# Altium schematic sheet Cap.SchDoc
size A4
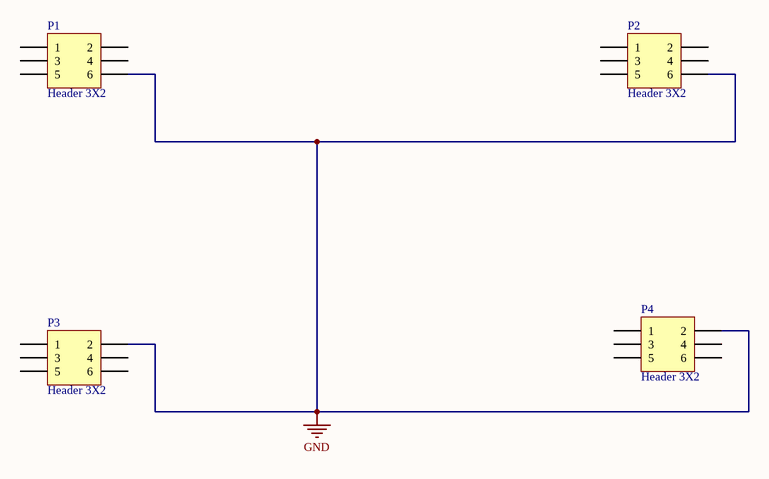
[diagram p0: Cap.SchDoc]

## Parts
P1  Header 3X2  [HDR2X3]
P2  Header 3X2  [HDR2X3]
P3  Header 3X2  [HDR2X3]
P4  Header 3X2  [HDR2X3]

## Nets
GND: P1.6 P2.6 P3.2 P4.2

Not connected (* = marked no-connect by the designer): P1 1 2 3 4 5; P2 1 2 3 4 5; P3 1 3 4 5 6; P4 1 3 4 5 6

## Library data of the parts
P1-P4 = Header 3X2: Header, 3-Pin, Dual row; LatestRevisionDate: 17-Jul-2002; LatestRevisionNote: Re-released for DXP Platform.; Publisher: Altium Limited; Distributeur: Farnell : 1022231